# Altium project TP4_REINGL.PrjPcb
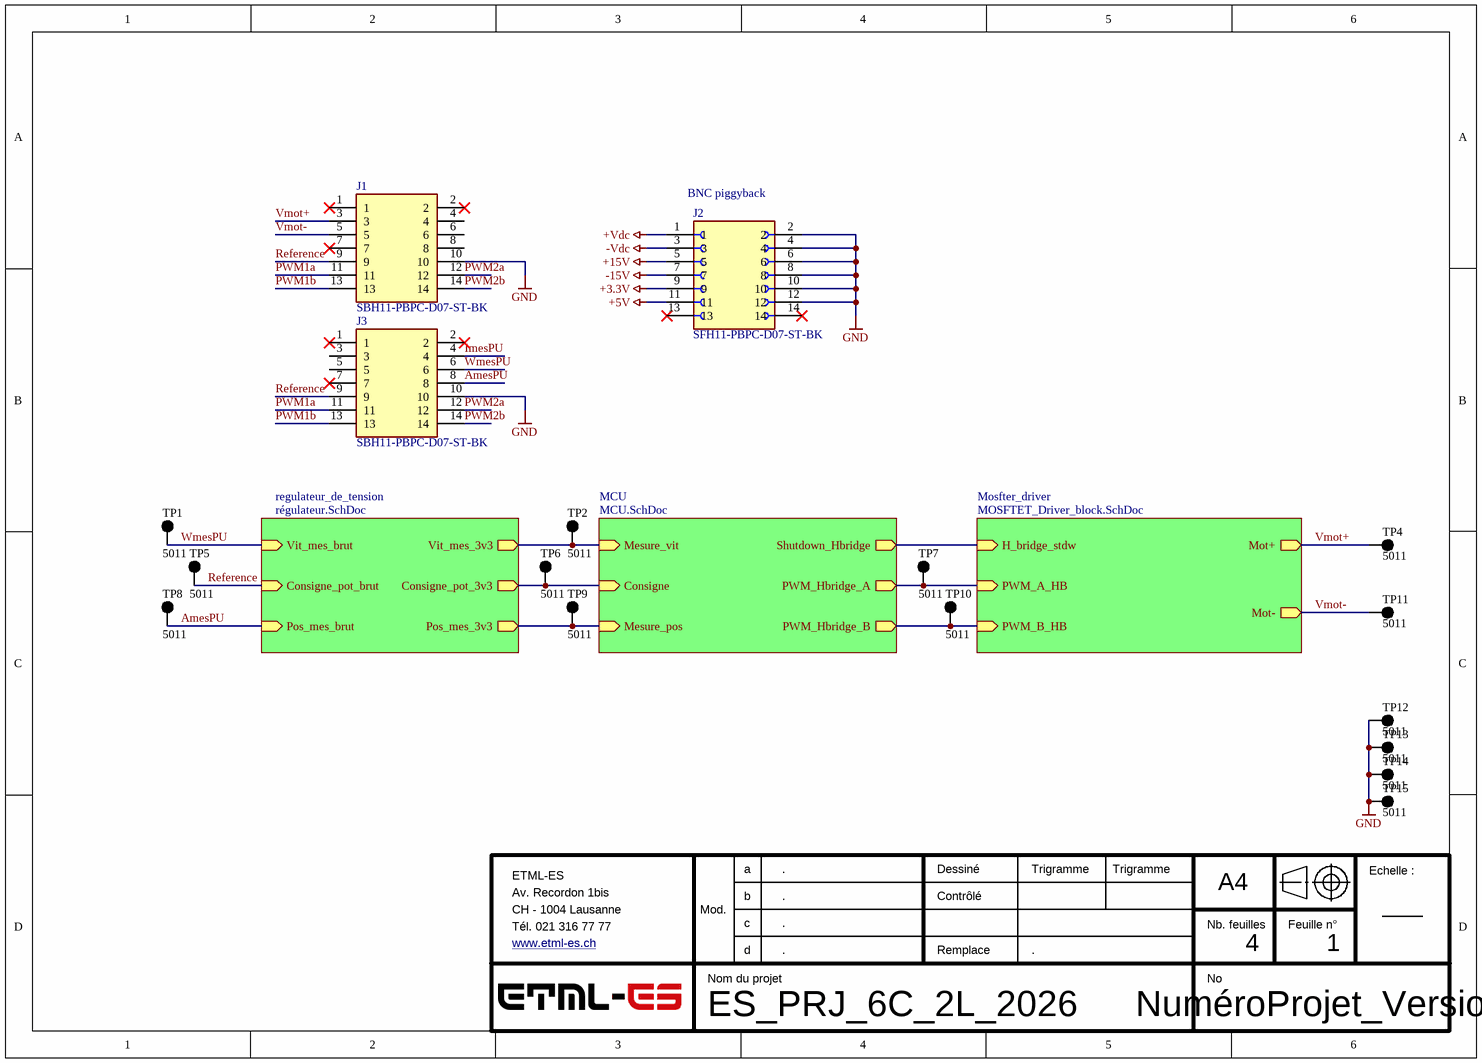
[diagram p0: ES_PRJ_6C_2L_2026.SchDoc]
BomCheckedBy: -; Date: Trigramme; DocumentNumber: NuméroProjet_Version; DrawnBy: Trigramme; Title: ES_PRJ_6C_2L_2026
4 sheets, 74 parts. Net scope: hierarchical (ports join the sheet entries above them; power ports are global).
Board file: ES_PRJ_6C_2L_2026.PcbDoc
Sheets:
  ES_PRJ_6C_2L_2026.SchDoc
    regulateur_de_tension = régulateur.SchDoc
    Mosfter_driver = MOSFTET_Driver_block.SchDoc
    MCU = MCU.SchDoc

## Sheet ES_PRJ_6C_2L_2026.SchDoc: ES_PRJ_6C_2L_2026
size 276 x 198 mm; Organization: ETML-ES; Address1: Av. Recordon 1bis; Address2: CH - 1004 Lausanne; Address3: Tél. 021 316 77 77; Address4: www.etml-es.ch; SheetNumber: 1; SheetTotal: 4; Replace: .; ModA: .; ModB: .; ModC: .; ModD: .

### Parts
J1  SBH11-PBPC-D07-ST-BK  [SULLINS_SBH11-PBPC-D07-ST-BK]
J2  SFH11-PBPC-D07-ST-BK  [SULLINS_SFH11-PBPC-D07-ST-BK]
J3  SBH11-PBPC-D07-ST-BK  [SULLINS_SBH11-PBPC-D07-ST-BK]
TP1  5011  [KSTN-5011_V]
TP2  5011  [KSTN-5011_V]
TP4  5011  [KSTN-5011_V]
TP5  5011  [KSTN-5011_V]
TP6  5011  [KSTN-5011_V]
TP7  5011  [KSTN-5011_V]
TP8  5011  [KSTN-5011_V]
TP9  5011  [KSTN-5011_V]
TP10  5011  [KSTN-5011_V]
TP11  5011  [KSTN-5011_V]
TP12  5011  [KSTN-5011_V]
TP13  5011  [KSTN-5011_V]
TP14  5011  [KSTN-5011_V]
TP15  5011  [KSTN-5011_V]

### Sub-sheets
MCU = MCU.SchDoc: Mesure_vit (in), Mesure_pos (in), Shutdown_Hbridge (out), PWM_Hbridge_A (out), PWM_Hbridge_B (out), Consigne (in)
Mosfter_driver = MOSFTET_Driver_block.SchDoc: PWM_A_HB (in), PWM_B_HB (in), H_bridge_stdw (in), Mot+ (out), Mot- (out)
regulateur_de_tension = régulateur.SchDoc: Pos_mes_brut (in), Pos_mes_3v3 (out), Vit_mes_3v3 (out), Vit_mes_brut (in), Consigne_pot_brut (in), Consigne_pot_3v3 (out)

### Nets
+3.3V: J2.9
+5V: J2.11
+15V: J2.5
+Vdc: J2.1
-15V: J2.7
-Vdc: J2.3
GND: J1.10 J2.2 J2.4 J2.6 J2.8 J2.10 J2.12 J3.10 TP12.1 TP13.1 TP14.1 TP15.1
AmesPU: J3.8 TP8.1 ; sheet regulateur_de_tension/Pos_mes_brut
ImesPU: J3.4
PWM1a: J1.11 J3.11
PWM1b: J1.13 J3.13
PWM2a: J1.12 J3.12
PWM2b: J1.14 J3.14
Reference: J1.9 J3.9 TP5.1 ; sheet regulateur_de_tension/Consigne_pot_brut
Vmot+: J1.3 TP4.1 ; sheet Mosfter_driver/Mot+
Vmot-: J1.5 TP11.1 ; sheet Mosfter_driver/Mot-
WmesPU: J3.6 TP1.1 ; sheet regulateur_de_tension/Vit_mes_brut
NetR13_1: TP2.1 ; sheet regulateur_de_tension/Vit_mes_3v3, sheet MCU/Mesure_vit
NetR14_1: TP6.1 ; sheet regulateur_de_tension/Consigne_pot_3v3, sheet MCU/Consigne
NetR18_1: TP9.1 ; sheet regulateur_de_tension/Pos_mes_3v3, sheet MCU/Mesure_pos
NetR19_2: sheet Mosfter_driver/H_bridge_stdw, sheet MCU/Shutdown_Hbridge
NetTP7_1: TP7.1 ; sheet Mosfter_driver/PWM_A_HB, sheet MCU/PWM_Hbridge_A
NetTP10_1: TP10.1 ; sheet Mosfter_driver/PWM_B_HB, sheet MCU/PWM_Hbridge_B

Not connected (* = marked no-connect by the designer): J1 1* 2* 4 6 7* 8; J2 13* 14*; J3 1* 2* 3 5 7*

### Notes on the sheet
- (near J2) BNC piggyback
- a
- Dessiné
- A4
- Echelle :
- Mod.
- b
- c
- d
- Contrôlé
- Remplace
- Nb. feuilles
- Feuille n°
- Nom du projet
- No

### Library data of the parts
J1 J3 = SBH11-PBPC-D07-ST-BK: Connector Header Through Hole 14 position 0.100 (2.54mm); MF: Sullins Connector; Value: *; Check_prices: https://www.snapeda.com/parts/SBH11-PBPC-D07-ST-BK/Sullins%20Connector%20Solutions/view-part/229418/?ref=eda; Availability: Warning; Price: None; MP: SBH11-PBPC-D07-ST-BK; Package: None; Purchase-URL: https://pricing.snapeda.com/search/part/SBH11-PBPC-D07-ST-BK/?ref=eda; SnapEDA_Link: https://www.snapeda.com/parts/SBH11-PBPC-D07-ST-BK/Sullins%20Connector%20Solutions/view-part/229418/?ref=snap
J2 = SFH11-PBPC-D07-ST-BK: 14 Position Header Connector Through Hole; MF: Sullins Connector; Value: *; Check_prices: https://www.snapeda.com/parts/SFH11-PBPC-D07-ST-BK/Sullins%20Connector%20Solutions/view-part/851415/?ref=eda; Availability: Warning; Package: None; SnapEDA_Link: https://www.snapeda.com/parts/SFH11-PBPC-D07-ST-BK/Sullins%20Connector%20Solutions/view-part/851415/?ref=snap; Purchase-URL: https://pricing.snapeda.com/search/part/SFH11-PBPC-D07-ST-BK/?ref=eda; Price: None; MP: SFH11-PBPC-D07-ST-BK
TP1 TP2 TP4-TP15 = CMP-1672-00003-4: Test Point, Black, Through Hole, RoHS, Bulk; Manufacturer: Keystone; ComponentLink2URL: http://www.keyelco.com/product-pdf.cfm?p=1320; Colour: Black; Pins: 1; REACH SVHC: No SVHC; ComponentLink1URL: http://www.keyelco.com/; PackageReference: 5011; Contact Plating: Silver; Package Quantity: 100; Packaging: Bulk; RoHSCompliant: true; Height: 8.12 mm; PackageDescription: 1-Pin Through Hole Device, Dia 3.17 mm; Mount: Through Hole; Mounting Technology: Through Hole; DatasheetVersion: Rev. F, 12/2013; ComponentLink1Description: Manufacturer URL; Contact Material: Bronze; ComponentLink2Description: Datasheet

## Sheet régulateur.SchDoc: ES_PRJ_6C_2L_2026
size A4; SheetNumber: 3; SheetTotal: 4
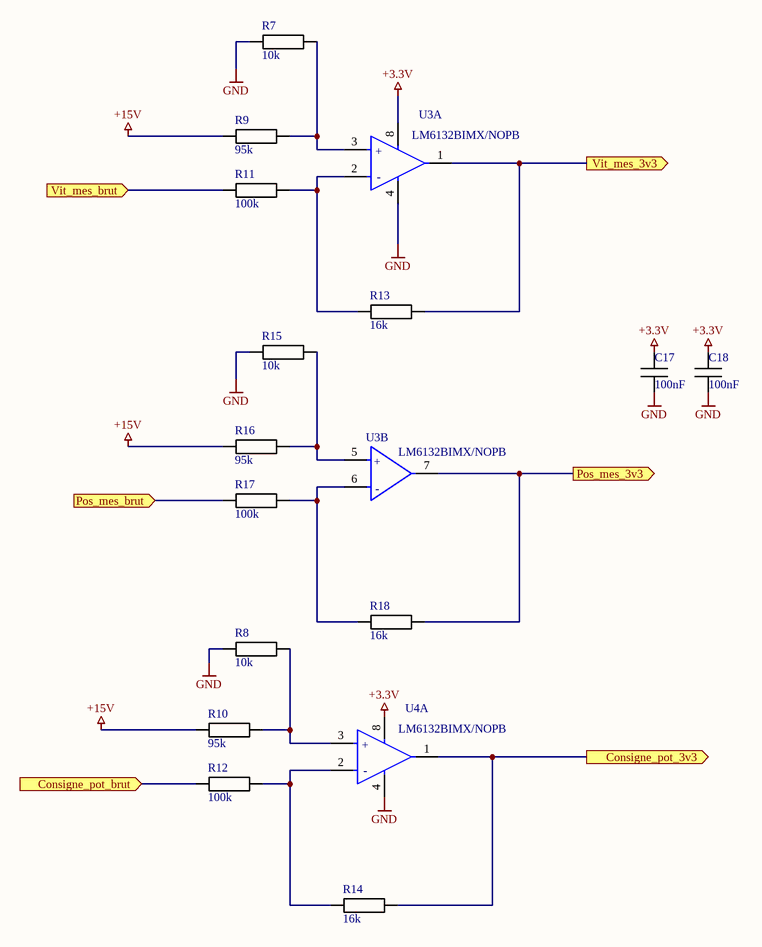
[diagram p1: régulateur.SchDoc]

### Parts
C17  100nF  [CAPC1608X08M]
C18  100nF  [CAPC1608X08M]
R7  10k  [RESC2012X06M]
R8  10k  [RESC2012X06M]
R9  95k  [RESC2012X06M]
R10  95k  [RESC2012X06M]
R11  100k  [RESC2012X06M]
R12  100k  [RESC2012X06M]
R13  16k  [RESC2012X06M]
R14  16k  [RESC2012X06M]
R15  10k  [RESC2012X06M]
R16  95k  [RESC2012X06M]
R17  100k  [RESC2012X06M]
R18  16k  [RESC2012X06M]
U3  LM6132BIMX/NOPB  [FP-LM6132BIMX-NOPB-MFG]  (parts A,B of 2)
U4  LM6132BIMX/NOPB  [FP-LM6132BIMX-NOPB-MFG]  (part A of 2)

### Ports
Consigne_pot_3v3 (out), Consigne_pot_brut (in), Pos_mes_3v3 (out), Pos_mes_brut (in), Vit_mes_3v3 (out), Vit_mes_brut (in)

### Nets
+3.3V: C17.2 C18.2 U3.8(V+) U4.8(V+)
+15V: R9.1 R10.1 R16.1
GND: C17.1 C18.1 R7.1 R8.1 R15.1 U3.4(V-) U4.4(V-)
AmesPU: R17.1 ; port Pos_mes_brut
Reference: R12.1 ; port Consigne_pot_brut
WmesPU: R11.1 ; port Vit_mes_brut
NetR7_2: R7.2 R9.2 U3.3(+IN_A)
NetR8_2: R8.2 R10.2 U4.3(+IN_A)
NetR11_2: R11.2 R13.2 U3.2(-IN_A)
NetR12_2: R12.2 R14.2 U4.2(-IN_A)
NetR13_1: R13.1 U3.1(OUT_A) ; port Vit_mes_3v3
NetR14_1: R14.1 U4.1(OUT_A) ; port Consigne_pot_3v3
NetR15_2: R15.2 R16.2 U3.5(+IN_B)
NetR17_2: R17.2 R18.2 U3.6(-IN_B)
NetR18_1: R18.1 U3.7(OUT_B) ; port Pos_mes_3v3

### Notes on the sheet
- (in symbol CMP-04895-000003-1, part A) +; -
- (in symbol CMP-04895-000003-1, part B) +; -

### Library data of the parts
C17 C18 = CMP-065-000000-2: CAPC 100nF X7R 50V 10% 1608 (0603 INCH); Manufacturer: TDK; Manufacturer Number: CGA3E2X7R1H104K080AA; IsStocked: 1; PN: PN-338083; Current: NULL; TemperatureRange: -55°C to +125°C; Voltage: 50V; Dielectric: X7R; Value: 100nF; Category: Passives; Supplier Price 1: 0.0100; Supplier Part Number 1: FAB.0603_C 100n; SubCategory: Condensateurs ceramique; Tolerance: ±10%; Supplier 1: ETML; TemperatureCoeff: NULL; Power: NULL
R7-R18 = CMP-066-000209-2: RES 68kohm  ±1% 0.125W 2012 (0805 INCH); Manufacturer Number: RC0805FR-0768KL; Manufacturer: Yageo; TemperatureRange: -55°C to 155°C; PN: PN-665325; Value: 68k; TemperatureCoeff: ±200ppm/°C; Voltage: 150V; IsStocked: 1; Supplier Part Number 1: FAB.0805_R 68k; Category: Passives; Supplier 1: ETML; SubCategory: Resistances couche epaisse; Power: 0.125W; Supplier Price 1: 0.0200; Tolerance: ±1%
U3 U4 = CMP-04895-000003-1: IC OPAMP GP 2 CIRCUIT 8SOIC; Manufacturer: Texas Instruments; Nominal Supply Current: 720uA; Number Of Channels: 2; Voltage Gain: 102V/mV; Input Offset Voltage: 1.7V; Max Dual Supply Voltage: 12V; Gain Bandwidth: 11MHz; Min Supply Voltage: 1.8V; Max Junction Temp: +150°C; Standoff Height: 0.11mm; Output Current Per Channel: 3.5mA; Min Dual Supply Voltage: 0.9V; Max Supply Voltage: 24V; Input Bias Current: 0.125uA; Digikey Description: IC OPAMP GP 2 CIRCUIT 8SOIC; Height: 1.75mm; ComponentLink2URL: http://www.ti.com/lit/ds/symlink/lm6132.pdf; Temperature Range High: +85°C; Device Class L2: Linear ICs; Manufacturer Part Number: LM6132BIMX/NOPB; Lead Free: Yes; ComponentLink2Description: Datasheet; Temperature: -40°C to +85°C; Device Class L1: Integrated Circuits (ICs); Category: IC; Temperature Range Low: -40°C; Automotive: No; RoHS: TRUE; Package: SOIC-8; Octopart: https://octopart.com/lm6132bimx%2Fnopb-texas+instruments-24814947; Mouser Description: Operational Amplifiers - Op Amps DUAL LOW POWER 10 MHZ RRIO OP AMP; Device Class L3: Amplifiers - Op Amps

## Sheet MOSFTET_Driver_block.SchDoc: ES_PRJ_6C_2L_2026
size A4; SheetNumber: 2; SheetTotal: 4
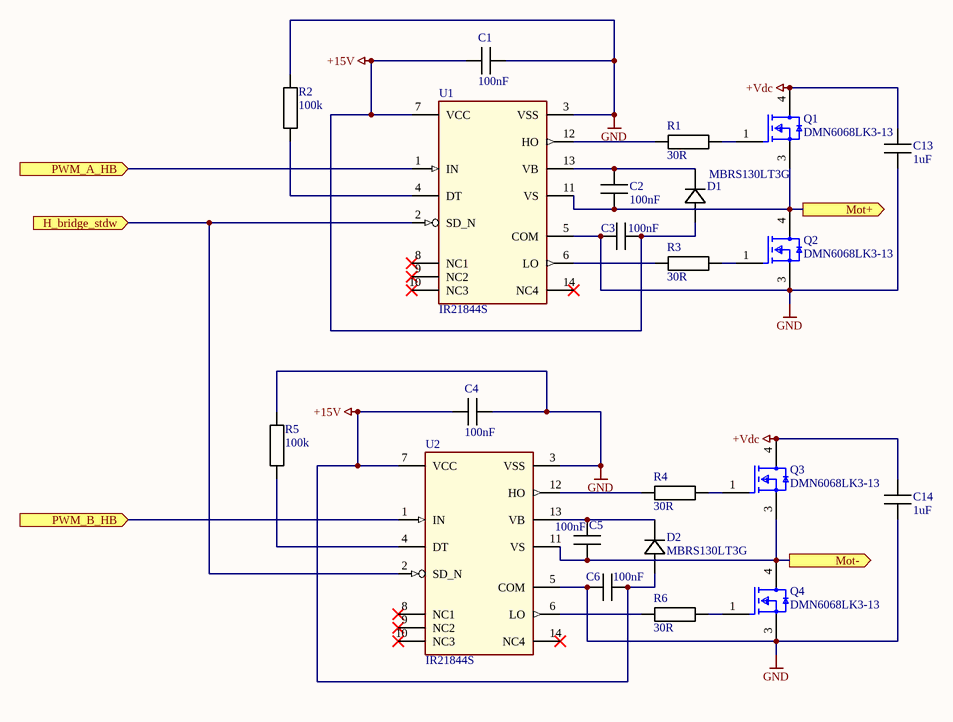
[diagram p2: MOSFTET_Driver_block.SchDoc]

### Parts
C1  100nF  [CAPC1608X08M]
C2  100nF  [CAPC1608X08M]
C3  100nF  [CAPC1608X08M]
C4  100nF  [CAPC1608X08M]
C5  100nF  [CAPC1608X08M]
C6  100nF  [CAPC1608X08M]
C13  1uF  [CAPC2012X08M]
C14  1uF  [CAPC2012X08M]
D1  MBRS130LT3G  [DIODE_SMB_2L_ONS]
D2  MBRS130LT3G  [DIODE_SMB_2L_ONS]
Q1  DMN6068LK3-13  [FP-TO252_DPAK-MFG]
Q2  DMN6068LK3-13  [FP-TO252_DPAK-MFG]
Q3  DMN6068LK3-13  [FP-TO252_DPAK-MFG]
Q4  DMN6068LK3-13  [FP-TO252_DPAK-MFG]
R1  30R  [RESC2012X06M]
R2  100k  [RESC2012X06M]
R3  30R  [RESC2012X06M]
R4  30R  [RESC2012X06M]
R5  100k  [RESC2012X06M]
R6  30R  [RESC2012X06M]
U1  IR21844S  [SOIC127P600X175-14N-12-V]
U2  IR21844S  [SOIC127P600X175-14N-12-V]

### Ports
H_bridge_stdw (in), Mot+ (out), Mot- (out), PWM_A_HB (in), PWM_B_HB (in)

### Nets
+15V: C1.2 C3.1 C4.2 C6.1 D1.2 D2.2 U1.7(VCC) U2.7(VCC)
+Vdc: C13.2 C14.2 Q1.4(D) Q3.4(D)
GND: C1.1 C3.2 C4.1 C6.2 C13.1 C14.1 Q2.3(S) Q4.3(S) R2.2 R5.2 U1.3(VSS) U1.5(COM) U2.3(VSS) U2.5(COM)
Vmot+: C2.2 Q1.3(S) Q2.4(D) U1.11(VS) ; port Mot+
Vmot-: C5.1 Q3.3(S) Q4.4(D) U2.11(VS) ; port Mot-
NetC2_1: C2.1 D1.1 U1.13(VB)
NetC5_2: C5.2 D2.1 U2.13(VB)
NetQ1_1: Q1.1(G) R1.2
NetQ2_1: Q2.1(G) R3.2
NetQ3_1: Q3.1(G) R4.2
NetQ4_1: Q4.1(G) R6.2
NetR1_1: R1.1 U1.12(HO)
NetR2_1: R2.1 U1.4(DT)
NetR3_1: R3.1 U1.6(LO)
NetR4_1: R4.1 U2.12(HO)
NetR5_1: R5.1 U2.4(DT)
NetR6_1: R6.1 U2.6(LO)
NetR19_2: U1.2(SD_N) U2.2(SD_N) ; port H_bridge_stdw
NetTP7_1: U1.1(IN) ; port PWM_A_HB
NetTP10_1: U2.1(IN) ; port PWM_B_HB

Not connected (* = marked no-connect by the designer): U1 8(NC1)* 9(NC2)* 10(NC3)* 14(NC4)*; U2 8(NC1)* 9(NC2)* 10(NC3)* 14(NC4)*

### Library data of the parts
C1-C6 = CMP-065-000000-2: as C17 on sheet régulateur; Voltage: 50V; Dielectric: X7R; Value: 100nF; Category: Passives; Supplier Price 1: 0.0100; Supplier Part Number 1: FAB.0603_C 100n; SubCategory: Condensateurs ceramique; Tolerance: ±10%; Supplier 1: ETML; TemperatureCoeff: NULL; Power: NULL
C13 C14 = CMP-065-000041-2: CAPC 1uF X5R 25V 10% 2012 (0805 INCH); Manufacturer: TDK; Manufacturer Number: C2012X5R1E105K125AA; Value: 1µF; TemperatureRange: -55°C to +85°C; IsStocked: 1; PN: PN-324029; Supplier 1: ETML; Category: Passives; Supplier Part Number 1: FAB.0805_C 1u; SubCategory: Condensateurs ceramique; Tolerance: ±10%; Supplier Price 1: 0.0223; Dielectric: X5R; Voltage: 25V
D1 D2 = MBRS130LT3G: Description; Manufacturer_Name: onsemi; Copyright: Copyright (C) 2025 Ultra Librarian. All rights reserved.; Manufacturer_Part_Number: MBRS130LT3G
Q1-Q4 = CMP-12801-000004-1: MOSFET N-CH 60V 6A DPAK; Manufacturer: Diodes Inc.; Transconductance: 19.7S; Input Capacitace At Vds: 502pF @ 30V; Gate To Source Voltage: 20V; Turn On Delay Time: 3.6ns; Typ Forward Diode Voltage: 0.98V; Max Forward Diode Voltage: 1.15V; Gate Charge At Vgs: 10.3nC @ 10V; Number Of Channels: 1; Threshold Vgs Max: 3V; Threshold Vgs Min: 1V; Power Dissipation: 2.12W; Max Junction Temp: +150°C; Rthja Max: 59°C/W; Reverse Recovery Charge: 929nC; Turn Off Delay Time: 11.9ns; Drain To Source Resistance: 0.068Ω; Standoff Height: 0mm; Depletion Mode: False; Reverse Recovery Time: 145ns; Pulse Drain Current: 22.2A; Automotive Grade: Grade 0; Category: Trans; Footprint Url: https://www.diodes.com/assets/Package-Files/TO252-DPAK.pdf; Temperature Range Low: -55°C; Device Class L3: MOSFETs; Automotive: Yes; Package: TO252 (DPAK); Drain To Source Breakdown Voltage: 60V; Device Class L1: Discrete Semiconductors; Mouser Description: Supplied as a Tape, N-Channel MOSFET, 8.5 A, 60 V, 3-Pin DPAK Diodes Inc DMN6068LK3-13; Continuous Drain Current: 6A; ComponentLink2Description: Datasheet; ComponentLink2URL: https://www.diodes.com/assets/Datasheets/DMN6068LK3.pdf; Device Class L2: Transistors; Height: 2.52mm; Number Of N Channels: 1; Temperature Range High: +150°C; Drain To Source Voltage: 60V; Temperature: -55°C to +150°C; Octopart: https://octopart.com/dmn6068lk3-13-diodes+inc.-17947797; Manufacturer Part Number: DMN6068LK3-13; RoHS: TRUE; Digikey Description: MOSFET N-CH 60V 6A DPAK; Lead Free: Yes
R1 R3 R4 R6 = CMP-066-000175-2: RES 100ohm  ±1% 0.125W 2012 (0805 INCH); Manufacturer: Yageo; Manufacturer Number: RC0805FR-07100RL; TemperatureCoeff: ±200ppm/°C; Value: 100; Voltage: 150V; PN: PN-217910; TemperatureRange: -55°C to 155°C; IsStocked: 1; SubCategory: Resistances couche epaisse; Supplier Price 1: 0.0200; Tolerance: ±1%; Supplier Part Number 1: FAB.0805_R 100R; Supplier 1: ETML; Category: Passives; Power: 0.125W
R2 R5 = CMP-066-000211-2: RES 100kohm  ±1% 0.125W 2012 (0805 INCH); Manufacturer: Yageo; Manufacturer Number: RC0805FR-07100KL; TemperatureCoeff: ±200ppm/°C; Voltage: 150V; TemperatureRange: -55°C to 155°C; IsStocked: 1; PN: PN-903408; Category: Passives; Supplier Part Number 1: FAB.0805_R 100k; Value: 100k; Tolerance: ±1%; Supplier Price 1: 0.0200; Power: 0.125W; SubCategory: Resistances couche epaisse; Supplier 1: ETML
U1 U2 = IR21844S: Half-bridge gate driver with integrated bootstrap diode; Alternate View: No; Symbol Type: Half-bridge gate driver with integrated bootstrap diode; Multiple Parts: No

## Sheet MCU.SchDoc: ES_PRJ_6C_2L_2026
size A4; SheetNumber: 4; SheetTotal: 4
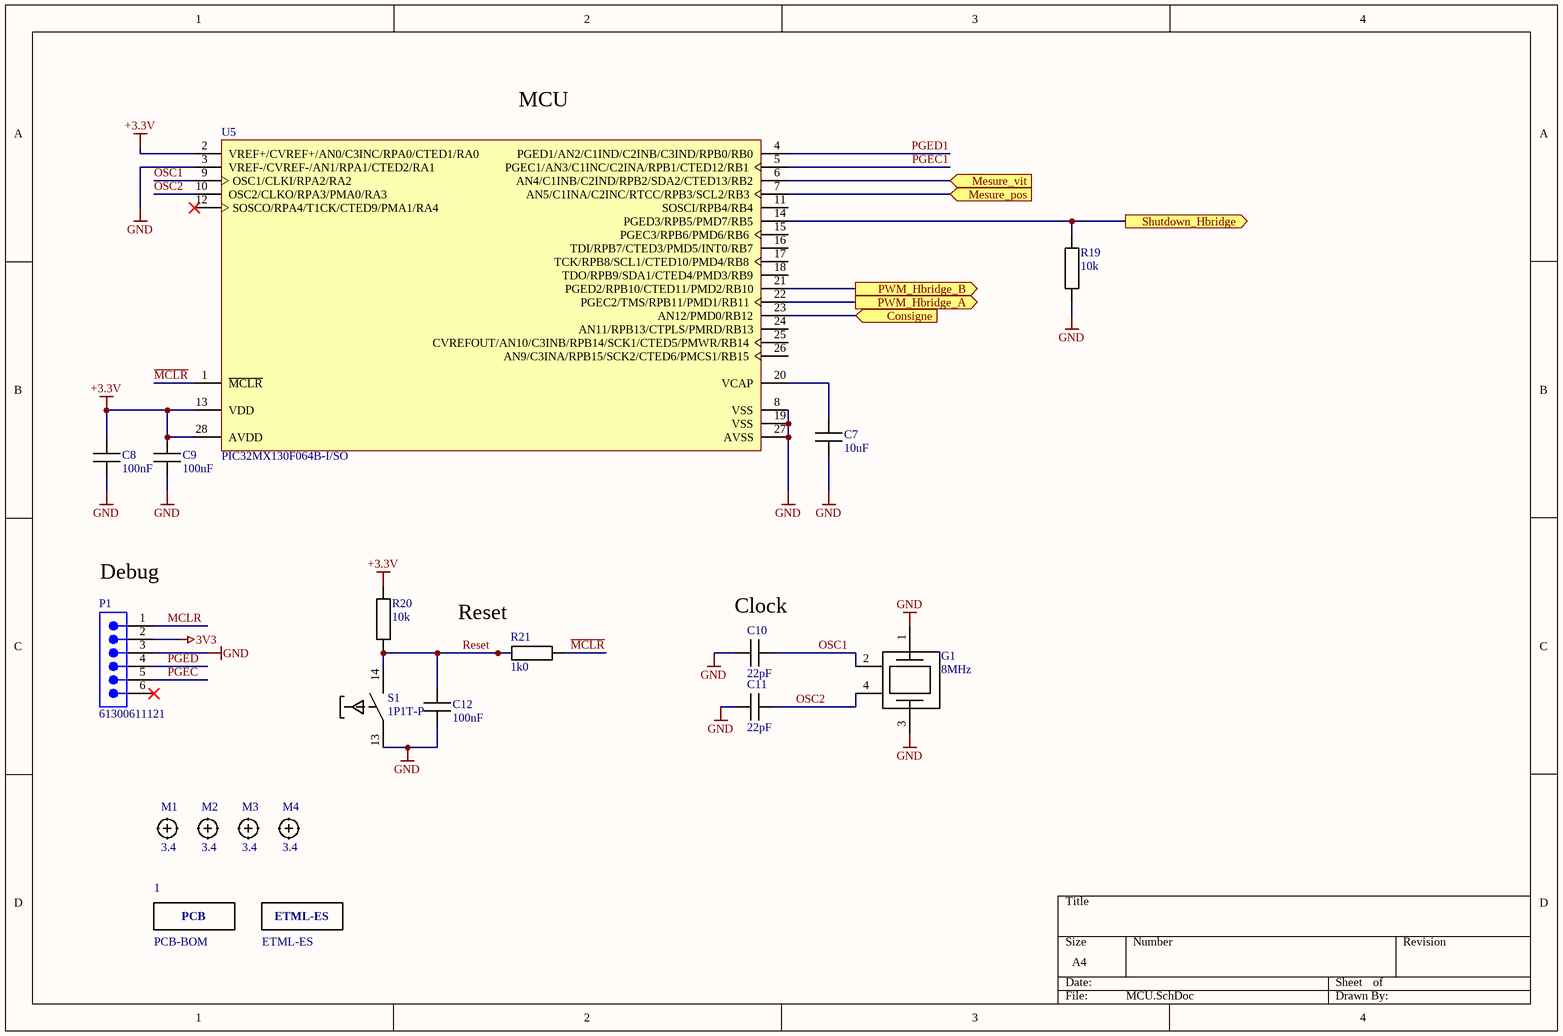
[diagram p3: MCU.SchDoc]

### Parts
1  PCB-BOM  (mechanical)
2  ETML-ES  [ETML-ES-CU-Footprint-1]  (no BOM)
C7  10uF  [CAPC2012X08M]
C8  100nF  [CAPC2012X08M]
C9  100nF  [CAPC2012X08M]
C10  22pF  [CAPC2012X08M]
C11  22pF  [CAPC2012X08M]
C12  100nF  [CAPC2012X08M]
G1  8MHz  [OSC60X35X10]
M1  3.4  [MECH-UHD340]  (no BOM)
M2  3.4  [MECH-UHD340]  (no BOM)
M3  3.4  [MECH-UHD340]  (no BOM)
M4  3.4  [MECH-UHD340]  (no BOM)
P1  61300611121  [61300611121]
R19  10k  [RESC2012X06M]
R20  10k  [RESC2012X06M]
R21  1k0  [RESC2012X06M]
S1  1P1T-P  [TE_1825910-6]
U5  PIC32MX130F064B-I/SO  [MCHP-SOIC-SO28_L]

### Ports
Consigne (in), Mesure_pos (in), Mesure_vit (in), PWM_Hbridge_A (out), PWM_Hbridge_B (out), Shutdown_Hbridge (out)

### Nets
3V3: P1.2
+3.3V: C8.2 C9.2 R20.2 U5.2(VREF+/CVREF+/AN0/C3INC/RPA0/CTED1/RA0) U5.13(VDD) U5.28(AVDD)
GND: C7.1 C8.1 C9.1 C10.2 C11.2 C12.1 G1.1 G1.3 P1.3 R19.1 S1.13 U5.3(VREF-/CVREF-/AN1/RPA1/CTED2/RA1) U5.8(VSS) U5.19(VSS) U5.27(AVSS)
~{MCLR}: R21.2 U5.1(~{MCLR})
MCLR: P1.1
OSC1: C10.1 G1.2 U5.9(OSC1/CLKI/RPA2/RA2)
OSC2: C11.1 G1.4 U5.10(OSC2/CLKO/RPA3/PMA0/RA3)
PGEC: P1.5
PGEC1: U5.5(PGEC1/AN3/C1INC/C2INA/RPB1/CTED12/RB1)
PGED: P1.4
PGED1: U5.4(PGED1/AN2/C1IND/C2INB/C3IND/RPB0/RB0)
Reset: C12.2 R20.1 R21.1 S1.14
NetC7_2: C7.2 U5.20(VCAP)
NetR13_1: U5.6(AN4/C1INB/C2IND/RPB2/SDA2/CTED13/RB2) ; port Mesure_vit
NetR14_1: U5.23(AN12/PMD0/RB12) ; port Consigne
NetR18_1: U5.7(AN5/C1INA/C2INC/RTCC/RPB3/SCL2/RB3) ; port Mesure_pos
NetR19_2: R19.2 U5.14(PGED3/RPB5/PMD7/RB5) ; port Shutdown_Hbridge
NetTP7_1: U5.22(PGEC2/TMS/RPB11/PMD1/RB11) ; port PWM_Hbridge_A
NetTP10_1: U5.21(PGED2/RPB10/CTED11/PMD2/RB10) ; port PWM_Hbridge_B

Not connected (* = marked no-connect by the designer): P1 6*; U5 11(SOSCI/RPB4/RB4) 12(SOSCO/RPA4/T1CK/CTED9/PMA1/RA4)* 15(PGEC3/RPB6/PMD6/RB6) 16(TDI/RPB7/CTED3/PMD5/INT0/RB7) 17(TCK/RPB8/SCL1/CTED10/PMD4/RB8) 18(TDO/RPB9/SDA1/CTED4/PMD3/RB9) 24(AN11/RPB13/CTPLS/PMRD/RB13) 25(CVREFOUT/AN10/C3INB/RPB14/SCK1/CTED5/PMWR/RB14) 26(AN9/C3INA/RPB15/SCK2/CTED6/PMCS1/RB15)

### Notes on the sheet
- (near U5) MCU
- (near P1) Debug
- (near R21) Reset
- (near C10) Clock
- (in symbol CMP-064-000001-1) PCB

### Library data of the parts
1 = CMP-064-000001-1: PCB element for BOM; IsStocked: False; PN: PN-108075; Category: Others; SubCategory: Dessins; Supplier Price 1: 0; Supplier 1: Eurocircuits Sàrl; Value: PCB-BOM; Supplier Part Number 1: -
2 = CMP-063-000030-2: Logo ETML-ES; IsStocked: Fasle; Value: ETML-ES-CU; Category: Others; SubCategory: Dessins
C7 = CMP-065-000040-2: CAPC 10uF X5R 16V 10% 2012 (0805 INCH); Manufacturer Number: C2012X5R1C106K085AC; Manufacturer: TDK; IsStocked: 1; Value: 10µF; PN: PN-654987; TemperatureRange: -55°C to +85°C; Tolerance: ±10%; Voltage: 16V; SubCategory: Condensateurs ceramique; Dielectric: X5R; Supplier Part Number 1: FAB.0805_C 10u; Category: Passives; Supplier Price 1: 0.0360; Supplier 1: ETML
C8-C12 = CMP-065-000038-2: CAPC 100nF X7R 50V 10% 2012 (0805 INCH); Manufacturer Number: C2012X7R1H104K085AA; Manufacturer: TDK; IsStocked: 1; TemperatureRange: -55°C to +125°C; PN: PN-747862; Supplier Part Number 1: FAB.0805_C 100n; Supplier Price 1: 0.0200; Voltage: 50V; Dielectric: X7R; Value: 100nF; SubCategory: Condensateurs ceramique; Category: Passives; Tolerance: ±10%; Supplier 1: ETML
G1 = CMP-059-000009-3: CRYSTAL 8MHz 6.0x3.5mm; Manufacturer: Farnell Multicomp; Manufacturer Number: ILCX08-JH5F18-8.000MHZ; PN: PN-881279; Tolerance: ±30ppm; TemperatureRange: -20°C to +70°C; IsStocked: 0; Category: IntegratedCircuits; Value: 8MHz; Supplier 1: Farnell; Supplier Part Number 1: 3572991; Supplier Price 1: 0.45; SubCategory: Horloges; TemperatureCoeff: ±30ppm
M1-M4 = CMP-063-000009-1: Unplated Hole 3.4mm; PN: PN-491366; IsStocked: False; SubCategory: Mecaniques; Category: Others; Value: 3.4
P1 = CMP-1502-01070-3: NexarPartId: 20084590; Current Rating: 3A; Pitch: 2.54mm; Gender: Male; Operating Supply Voltage: 250V; Connector Type: Male Pin; Number of Positions: 6; Contact Resistance: 20mΩ; Packaging: Bulk; Number of Pins: 6; Number of Rows: 1; Contact Plating: Gold; Lead Free: Lead Free; RoHS: Compliant; Contact Mating Length: 5.9944mm; Voltage Rating: 250V; REACH SVHC: Unknown; Contact Gender: Male; Housing Material: PBT; Min Operating Temperature: -40°C; Lead Pitch: 2.54mm; Mount: Through Hole; Number of Contacts: 6; Max Operating Temperature: 105°C; Contact Material: Copper; Orientation: Vertical; Termination: Through Hole; Color: Black; Height: 8.89mm
R19 R20 = CMP-066-000199-2: RES 10kohm  ±1% 0.125W 2012 (0805 INCH); Manufacturer Number: RC0805FR-0710KL; Manufacturer: Yageo; PN: PN-374909; TemperatureCoeff: ±200ppm/°C; Voltage: 150V; TemperatureRange: -55°C to 155°C; IsStocked: 1; Tolerance: ±1%; Category: Passives; Value: 10k; Supplier Price 1: 0.0200; Supplier Part Number 1: FAB.0805_R 10k; Supplier 1: ETML; SubCategory: Resistances couche epaisse; Power: 0.125W
R21 = CMP-066-000187-2: RES 1.0kohm  ±1% 0.125W 2012 (0805 INCH); Manufacturer: Yageo; Manufacturer Number: RC0805FR-071KL; Value: 1k; PN: PN-746409; TemperatureRange: -55°C to 155°C; IsStocked: 1; TemperatureCoeff: ±200ppm/°C; Voltage: 150V; Supplier 1: ETML; SubCategory: Resistances couche epaisse; Supplier Price 1: 0.0200; Supplier Part Number 1: FAB.0805_R 1k0; Category: Passives; Tolerance: ±1%; Power: 0.125W
S1 = CMP-058-000005-2: SW 600X600X500 24V 50mA THT; Manufacturer Number: 1825910-6; Manufacturer: TE Connectivity; TemperatureRange: -35°C to +85 °C; IsStocked: True; PN: PN-638027; Voltage: 24V; Current: 50mA; SubCategory: Commutateurs; Category: Electromechanical; Supplier Part Number 1: 135-66-547; Supplier 1: Distrelec AG; Supplier Price 1: 0.1642; Value: 1P1T-P
U5 = CMP-0048-00454-1: 32-bit Microcontroller with Audio and Graphics Interface, USB and Advanced Analog, 40 MHz, 21 I/O, PMP, -40 to 85 degC, 28-pin SOIC (SO28), Tube; Manufacturer: Microchip; ComponentLink4URL: http://www.microchip.com/PIC32MX130F064B; DatasheetVersion: Rev. E; ComponentLink1URL: http://www.microchip.com; ComponentLink2URL: http://ww1.microchip.com/downloads/en/DeviceDoc/61168E.pdf; PackageDescription: 28-Lead Plastic Small Outline, 17.9 x 7.5 mm Body, 1.27 mm Pitch; PackageVersion: C04-052C; Mounting Technology: Surface Mount; ComponentLink2Description: Datasheet; ComponentLink3URL: http://www.microchip.com/stellent/groups/techpub_sg/documents/packagingspec/en012702.pdf; PartNumber: PIC32MX130F064B-I/SO; PackageReference: SOIC-SO28; ComponentLink1Description: Manufacturer URL; ComponentLink3Description: Package Specification; ComponentLink4Description: Product URL

## Nets that join several sheets
+3.3V: ES_PRJ_6C_2L_2026 (J2.9), régulateur (C17.2 C18.2 U3.8 U4.8), MCU (6 pins)
+15V: ES_PRJ_6C_2L_2026 (J2.5), régulateur (R9.1 R10.1 R16.1), MOSFTET_Driver_block (8 pins)
+Vdc: ES_PRJ_6C_2L_2026 (J2.1), MOSFTET_Driver_block (C13.2 C14.2 Q1.4 Q3.4)
GND: ES_PRJ_6C_2L_2026 (12 pins), régulateur (7 pins), MOSFTET_Driver_block (14 pins), MCU (15 pins)
AmesPU: ES_PRJ_6C_2L_2026 (J3.8 TP8.1), régulateur (R17.1)
NetR13_1: ES_PRJ_6C_2L_2026 (TP2.1), régulateur (R13.1 U3.1), MCU (U5.6)
NetR14_1: ES_PRJ_6C_2L_2026 (TP6.1), régulateur (R14.1 U4.1), MCU (U5.23)
NetR18_1: ES_PRJ_6C_2L_2026 (TP9.1), régulateur (R18.1 U3.7), MCU (U5.7)
NetR19_2: MOSFTET_Driver_block (U1.2 U2.2), MCU (R19.2 U5.14)
NetTP7_1: ES_PRJ_6C_2L_2026 (TP7.1), MOSFTET_Driver_block (U1.1), MCU (U5.22)
NetTP10_1: ES_PRJ_6C_2L_2026 (TP10.1), MOSFTET_Driver_block (U2.1), MCU (U5.21)
Reference: ES_PRJ_6C_2L_2026 (J1.9 J3.9 TP5.1), régulateur (R12.1)
Vmot+: ES_PRJ_6C_2L_2026 (J1.3 TP4.1), MOSFTET_Driver_block (C2.2 Q1.3 Q2.4 U1.11)
Vmot-: ES_PRJ_6C_2L_2026 (J1.5 TP11.1), MOSFTET_Driver_block (C5.1 Q3.3 Q4.4 U2.11)
WmesPU: ES_PRJ_6C_2L_2026 (J3.6 TP1.1), régulateur (R11.1)